# EAGLE schematic high_voltage (EAGLE 9.6.1)
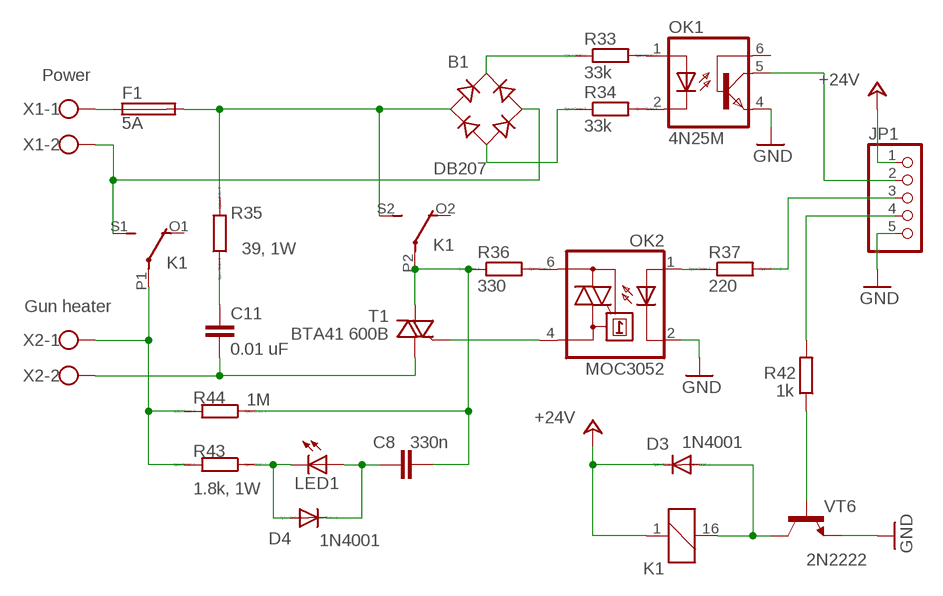
[diagram p0: schematic, sheet 1]

## Parts
B1  DB207  B-DIL  [B-DIL]
C8  330n  C-EU025-025X050  [C025-025X050]
C11  0.01 uF  C-EU050-024X044  [C050-024X044]
D3  1N4001  1N4004  [DO41-10]
D4  1N4001  1N4004  [DO41-10]
F1  5A  TE5  [TE5]
JP1  PINHD-1X5/90  [1X05/90]
K1  351  [351]
LED1  LED-3MM-NO_SILK  [LED3MM-NS]
OK1  4N25M  [DIL06]
OK2  MOC3052  MOC3021M  [DIL06]
R33  33k  R0204/7  [0204/7]
R34  33k  R0204/7  [0204/7]
R35  39, 1W  R0204/7  [0204/7]
R36  330  R0204/7  [0204/7]
R37  220  R0204/7  [0204/7]
R42  1k  R-EU_0204/5  [0204/5]
R43  1.8k, 1W  R0204/7  [0204/7]
R44  1M  R0204/7  [0204/7]
T1  BTA41 600B  BTA26-H  [TOP3L-1]
VT6  2N2222  [TO18]
X1  Power  W237-102  [W237-102]
X2  Gun heater  W237-102  [W237-102]

## Nets
+24V: D3.C JP1.1 K1.1
GND: JP1.5 OK1.4(EMI) OK2.2(C) VT6.1(E)
N$1: JP1.4 R42.2
N$38: R42.1 VT6.2(B)
N$40: B1.AC2 K1.S1(2:S) X1.2
N$44: C11.2 T1.A1 X2.2
N$45: C11.1 R35.1
N$46: B1.AC1 F1.2 K1.S2(3:S) R35.2
N$47: OK2.4(A1) T1.G
N$48: OK2.6(A2) R36.2
N$49: OK2.1(A) R37.1
N$51: B1.+ R33.1
N$52: OK1.1(A) R33.2
N$53: OK1.2(C) R34.2
N$54: B1.- R34.1
N$55: JP1.2 OK1.5(COL)
N$60: JP1.3 R37.2
N$62: F1.1 X1.1
N$66: D3.A K1.16 VT6.3(C)
N$68: K1.P1(2:P) R43.2 R44.2 X2.1
N$69: C8.1 D4.C LED1.A
N$71: D4.A LED1.K(C) R43.1
N$72: C8.2 K1.P2(3:P) R36.1 R44.1 T1.A2
Unconnected: K1.O1(2:O) K1.O2(3:O) OK1.6(BAS)

## Library data of the parts
B1 = rectifier:B-DIL: RECTIFIER
C8 C11 = rcl:C-EU: CAPACITOR, European symbol; SPICEPREFIX: C
D3 D4 = diode:1N4004: DIODE general purpose rectifier, 1 A
F1 = fuse:TE5: FUSE Wickmann; OC_FARNELL: unknown; OC_NEWARK: unknown
JP1 = pinhead:PINHD-1X5: PIN HEADER
K1 = relay:351: RELAY 2 x switch, Omron; OC_FARNELL: unknown; OC_NEWARK: unknown
LED1 = SparkFun:LED: LEDs Standard schematic elements and footprints for 5mm, 3mm, 1206, and 0603 sized LEDs. 5mm - Spark Fun Electronics SKU : COM-00529 (and others)
OK1 = optocoupler:4N*?M: General Purpose 6-Pin Phototransistor Optocouplers Source: http://www.fairchildsemi.com/ds/4N/4N35-M.pdf; MPN: 4N25-M; OC_FARNELL: 1021349; OC_NEWARK: 98K9084
OK2 = optocoupler:MOC30*M: RANDOM-PHASE OPTOISOLATORS TRIAC DRIVER OUTPUT Source: http://www.fairchildsemi.com MOC3020-M.pdf; MF: FAIRCHILD SEMICONDUCTOR; MPN: MOC3021-M; OC_FARNELL: 1021365; OC_NEWARK: 95B7895
R33-R37 R43 R44 = eagle-ltspice:R: RESISTOR, European symbol; SPICEMODEL: NONE; SPICEPREFIX: R
R42 = rcl:R-EU_: RESISTOR, European symbol; SPICEPREFIX: R
T1 = triac:BTA26: 25A TRIAC Source: http://www.st.com/stonline/products/literature/ds/7470.pdf
VT6 = transistor:2N2222: NPN TRANSISTOR
X1 X2 = con-wago-500:W237-102: WAGO SCREW CLAMP; MPN: 237-102; OC_FARNELL: unknown; OC_NEWARK: 70K9898